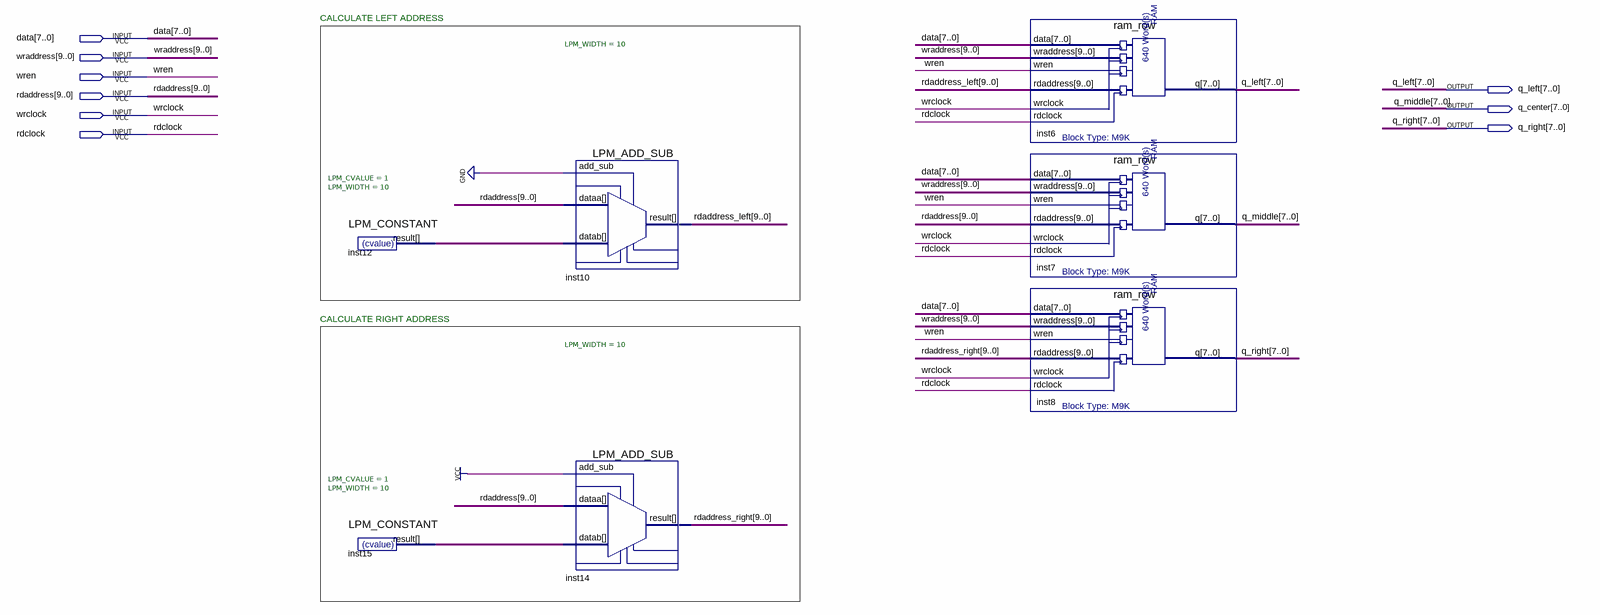
[diagram p0: schematic sheet]
// Quartus schematic parallel_ram.bdf as structural Verilog: 7 symbols, 9 pins
module parallel_ram (
  input  [7:0] data,
  input  [9:0] wraddress,
  input  wren,
  input  [9:0] rdaddress,
  input  wrclock,
  input  rdclock,
  output [7:0] q_left,
  output [7:0] q_center,
  output [7:0] q_right
);

  wire [9:0] inst12_result, inst15_result, rdaddress_left, rdaddress_right;

  LPM_CONSTANT #(.LPM_CVALUE(1), .LPM_WIDTH(10)) inst12 (.result(inst12_result));
  LPM_CONSTANT #(.LPM_CVALUE(1), .LPM_WIDTH(10)) inst15 (.result(inst15_result));
  LPM_ADD_SUB #(.LPM_WIDTH(10)) inst10 (
    .add_sub(1'b0), .dataa(rdaddress), .datab(inst12_result), .result(rdaddress_left));
  LPM_ADD_SUB #(.LPM_WIDTH(10)) inst14 (
    .add_sub(1'b1), .dataa(rdaddress), .datab(inst15_result), .result(rdaddress_right));
  ram_row inst6 (
    .data(data), .wraddress(wraddress), .wren(wren), .rdaddress(rdaddress_left), .wrclock(wrclock),
    .rdclock(rdclock), .q(q_left));
  ram_row inst7 (
    .data(data), .wraddress(wraddress), .wren(wren), .rdaddress(rdaddress), .wrclock(wrclock),
    .rdclock(rdclock), .q(q_center));
  ram_row inst8 (
    .data(data), .wraddress(wraddress), .wren(wren), .rdaddress(rdaddress_right), .wrclock(wrclock),
    .rdclock(rdclock), .q(q_right));

  // Other names for the same wires on the sheet: q_middle[7:0] = q_center

  // Notes on the sheet:
  //   CALCULATE LEFT ADDRESS
  //   CALCULATE RIGHT ADDRESS
endmodule
